# Altium project PCB_Project1.PrjPCB
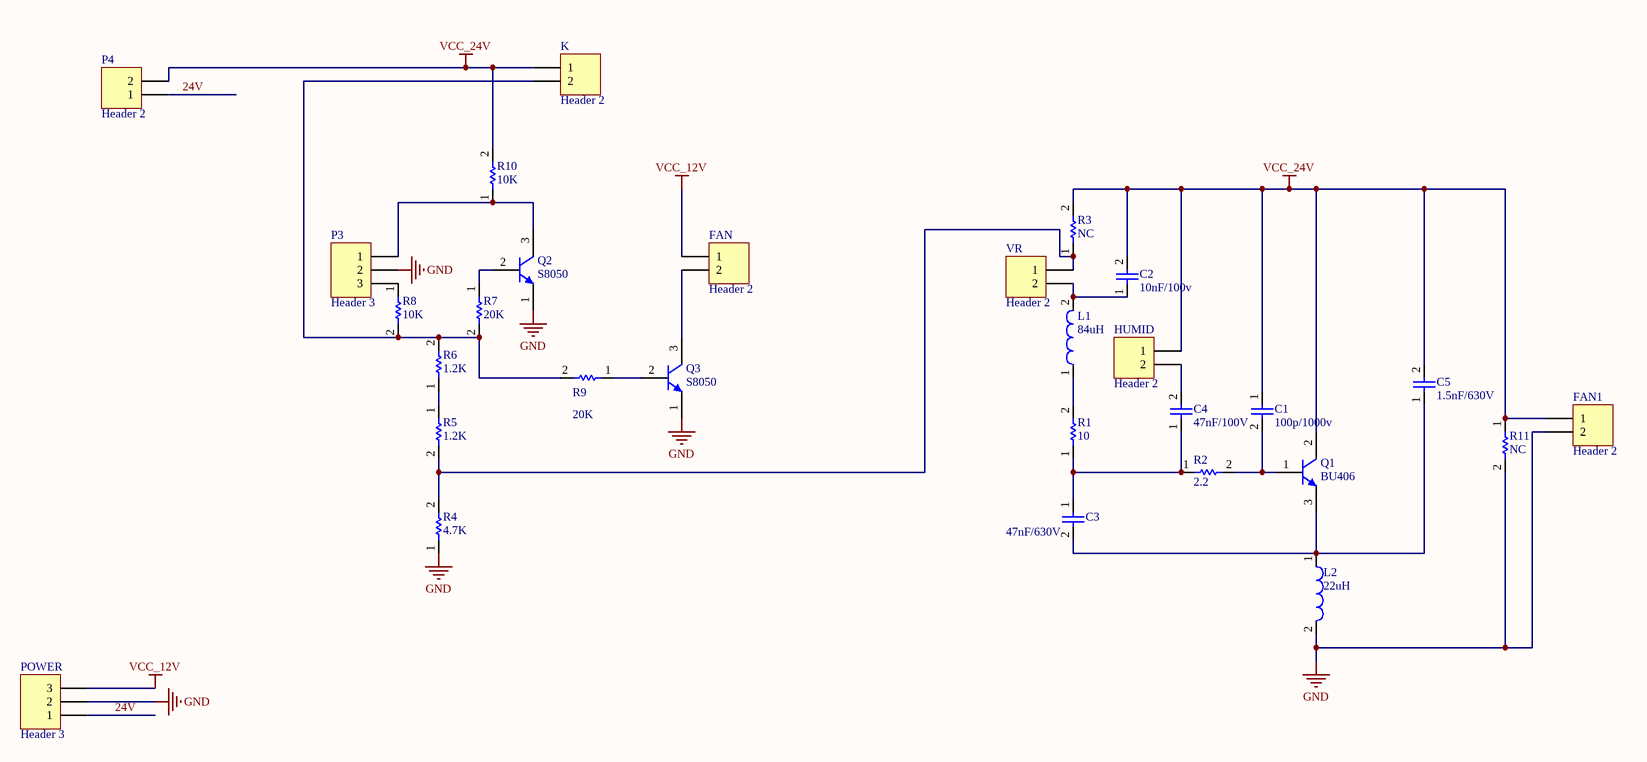
[diagram p0: Sheet1.SchDoc]
1 sheet, 29 parts. Net scope: global (net labels, ports and power ports of the same name join across sheets).
Board file: PCB1.PcbDoc

## Sheet Sheet1.SchDoc
size A3

### Parts
C1  100p/1000v  [CAP_5MM]
C2  10nF/100v  [CAP_5MM]
C3  47nF/630V  [AXIAL-0.4]
C4  47nF/100V  [AXIAL-0.4]
C5  1.5nF/630V  [AXIAL-0.3]
FAN  Header 2  [SIP-2L]
FAN1  Header 2  [SIP-2L]
HUMID  Header 2  [SIP-2L]
K  Header 2  [SIP-2L]
L1  84uH  [AXIAL-0.5]
L2  22uH  [6*8]
P3  Header 3  [SIP-3L]
P4  Header 2  [SIP-2L]
POWER  Header 3  [SIP-3L]
Q1  BU406  [to220]
Q2  S8050  [to-92]
Q3  S8050  [to-92]
R1  10  [AXIAL-0.4]
R2  2.2  [AXIAL-0.4]
R3  NC  [AXIAL-0.3]
R4  4.7K  [AXIAL-0.4]
R5  1.2K  [AXIAL-0.4]
R6  1.2K  [AXIAL-0.4]
R7  20K  [AXIAL-0.4]
R8  10K  [AXIAL-0.4]
R9  20K  [AXIAL-0.4]
R10  10K  [AXIAL-0.4]
R11  NC  [AXIAL-0.4]
VR  Header 2  [SIP-2L]

### Nets
GND: FAN1.2 L2.2 P3.2 POWER.2 Q2.1(E) Q3.1(E) R4.1 R11.2
VCC_12V: FAN.1 POWER.3
VCC_24V: C1.1 C2.2 C5.2 FAN1.1 HUMID.1 K.1 P4.2 Q1.2(C) R3.2 R10.2 R11.1
24V: P4.1 POWER.1
NetC1_2: C1.2 Q1.1(B) R2.2
NetC2_1: C2.1 L1.2 VR.2
NetC3_1: C3.1 C4.1 R1.1 R2.1
NetC3_2: C3.2 C5.1 L2.1 Q1.3(E)
NetC4_2: C4.2 HUMID.2
NetFAN_2: FAN.2 Q3.3(C)
NetK_2: K.2 R6.2 R7.2 R8.2 R9.2
NetL1_1: L1.1 R1.2
NetP3_1: P3.1 Q2.3(C) R10.1
NetP3_3: P3.3 R8.1
NetQ2_2: Q2.2(B) R7.1
NetQ3_2: Q3.2(B) R9.1
NetR3_1: R3.1 R4.2 R5.2 VR.1
NetR5_1: R5.1 R6.1

### Library data of the parts
C1-C5 = Cap: Capacitor; Value: 1nF/100V; Published: 8-Jun-2000; LatestRevisionDate: 17-Jul-2002; LatestRevisionNote: Re-released for DXP Platform.; PackageReference: RAD-0.3; Publisher: Altium Limited
FAN FAN1 HUMID K P4 VR = Header 2: Header, 2-Pin; LatestRevisionDate: 17-Jul-2002; LatestRevisionNote: Re-released for DXP Platform.; Publisher: Altium Limited
L1 L2 = Inductor: Code_IEC: 1005; Value: 10uH; Published: 8-Jun-2000; LatestRevisionDate: 29-May-2009; LatestRevisionNote: IPC-7351 Footprint Added.; PackageReference: 0402-A; Publisher: Altium Limited; PackageDescription: Chip Inductor; Code_JEITA: 0402
P3 POWER = Header 3: Header, 3-Pin; LatestRevisionDate: 17-Jul-2002; LatestRevisionNote: Re-released for DXP Platform.; Publisher: Altium Limited
Q1-Q3 = NPN: NPN Bipolar Transistor; Published: 8-Jun-2000; LatestRevisionDate: 17-Jul-2002; LatestRevisionNote: Re-released for DXP Platform.; PackageReference: TO-226; Publisher: Altium Limited; Code_JEDEC: TO-226-AA
R1-R11 = Res Semi: Semiconductor Resistor; Value: 1K; Published: 8-Jun-2000; LatestRevisionDate: 17-Jul-2002; LatestRevisionNote: Re-released for DXP Platform.; PackageReference: AXIAL-0.5; Publisher: Altium Limited